# EAGLE design MotorControl (EAGLE 7.4.0)
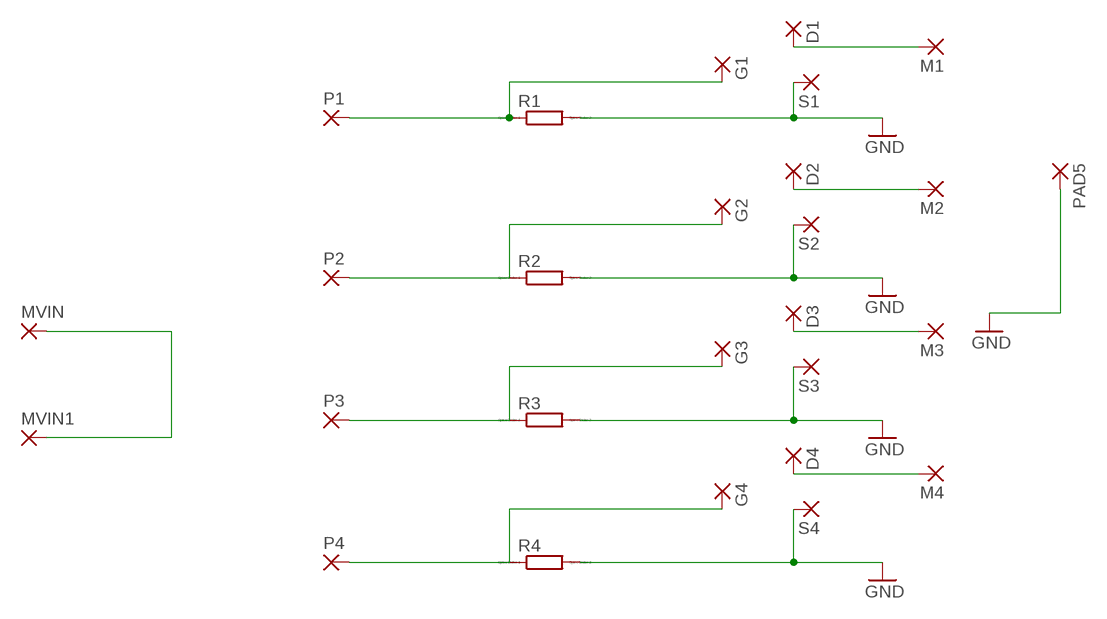
[diagram p0: schematic, sheet 1]

## Parts
D1  1,6/0,8  [1,6/0,8]
D2  1,6/0,8  [1,6/0,8]
D3  1,6/0,8  [1,6/0,8]
D4  1,6/0,8  [1,6/0,8]
G1  1,6/0,8  [1,6/0,8]
G2  1,6/0,8  [1,6/0,8]
G3  1,6/0,8  [1,6/0,8]
G4  1,6/0,8  [1,6/0,8]
M1  2,15/1,0  [2,15/1,0]
M2  2,15/1,0  [2,15/1,0]
M3  2,15/1,0  [2,15/1,0]
M4  2,15/1,0  [2,15/1,0]
MVIN  2,15/1,0  [2,15/1,0]
MVIN1  2,15/1,0  [2,15/1,0]
P1  2,15/1,0  [2,15/1,0]
P2  2,15/1,0  [2,15/1,0]
P3  2,15/1,0  [2,15/1,0]
P4  2,15/1,0  [2,15/1,0]
PAD5  2,15/1,0  [2,15/1,0]
R1  R0207/10  [0207/10]
R2  R0207/10  [0207/10]
R3  R0207/10  [0207/10]
R4  R0207/10  [0207/10]
S1  1,6/0,8  [1,6/0,8]
S2  1,6/0,8  [1,6/0,8]
S3  1,6/0,8  [1,6/0,8]
S4  1,6/0,8  [1,6/0,8]

## Nets
GND: PAD5.1(P) R1.2 R2.2 R3.2 R4.2 S1.1(P) S2.1(P) S3.1(P) S4.1(P)
N$1: G1.1(P) P1.1(P) R1.1
N$2: D1.1(P) M1.1(P)
N$3: G2.1(P) P2.1(P) R2.1
N$4: D3.1(P) M3.1(P)
N$5: G3.1(P) P3.1(P) R3.1
N$6: D4.1(P) M4.1(P)
N$7: G4.1(P) P4.1(P) R4.1
N$8: D2.1(P) M2.1(P)
N$9: MVIN1.1(P) MVIN.1(P)

## Library data of the parts
D1-D4 G1-G4 S1-S4 = wirepad:1,6/0,8: THROUGH-HOLE PAD
M1-M4 MVIN MVIN1 P1-P4 PAD5 = wirepad:2,15/1,0: THROUGH-HOLE PAD
R1-R4 = eagle-ltspice:R: RESISTOR, European symbol; SPICEMODEL: NONE; SPICEPREFIX: R

## Board
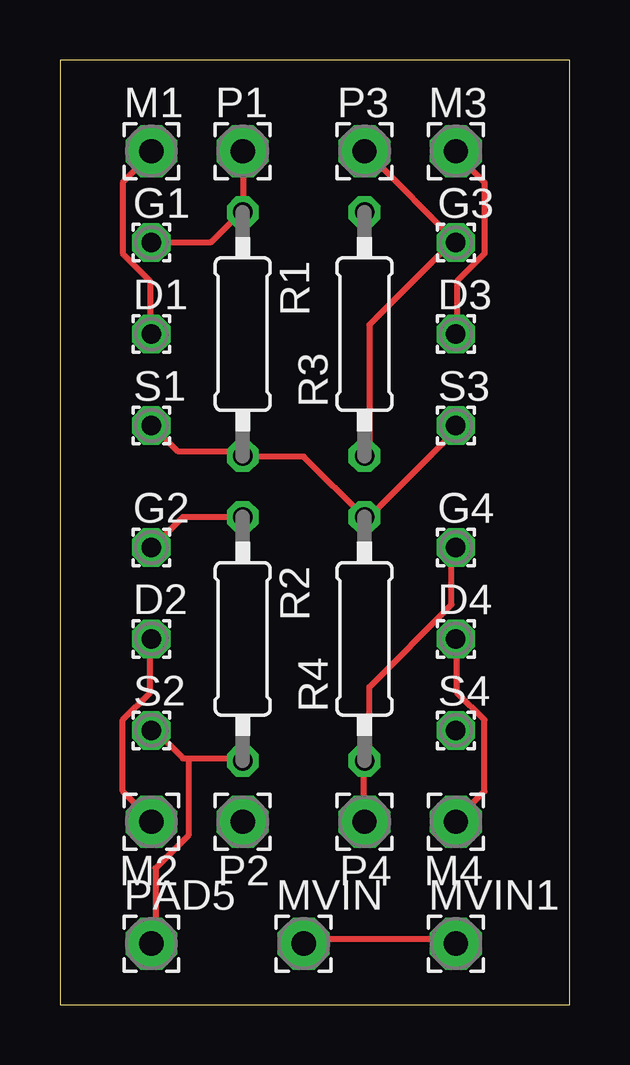
[diagram p1: board, top side]
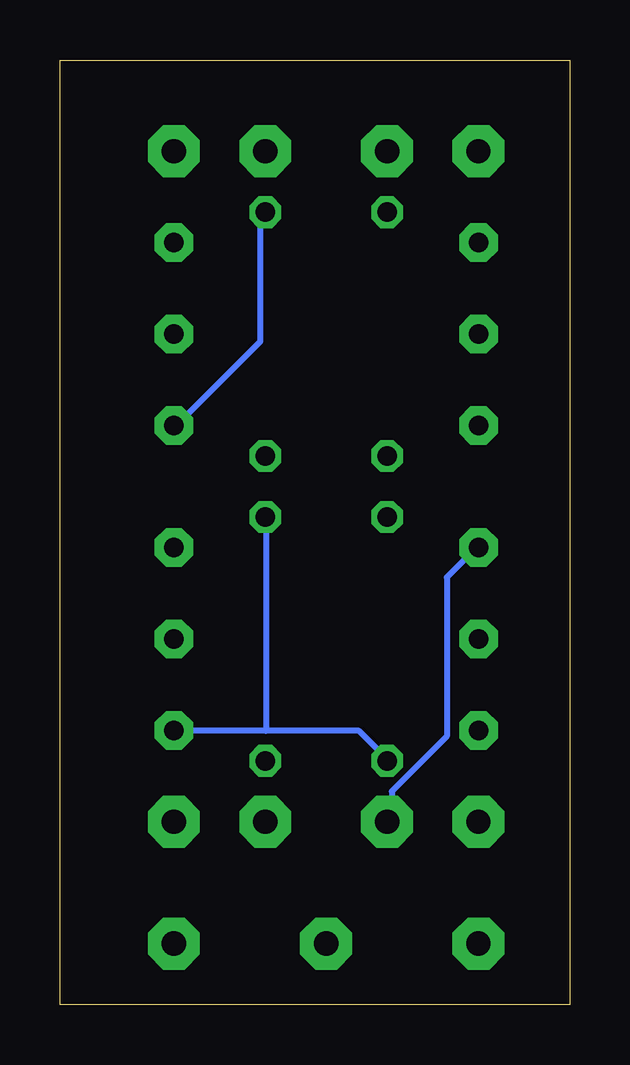
[diagram p2: board, bottom side, seen from below]

Size 21.26 x 39.36 mm. Coordinates in mm from the lower left corner, seen from the top.
Outline: 0,0 21.26,0 21.26,39.36 0,39.36 0,0
Copper layers (1*16): Top 0.035mm / dielectric 1.5mm / Bottom 0.035mm
Design rules "default": minimum track width 10mil, minimum drill 24mil, track to track 8mil, track to pad 8mil, pad to pad 8mil, via to via 8mil, smd to smd 8mil, copper to edge 40mil, drill to drill 8mil, minimum pad ring 10mil, minimum via ring 8mil, stop-mask expansion 4mil, vias tented up to drill 0mil, thermal gap 10mil

### Footprints (pad centres in the part's own frame; a part is rotated, then mirrored left to right if it is on the bottom)
1,6/0,8 = drill 0.813 pad 1.6 octagon: 1 0,0
2,15/1,0 = drill 1.016 pad 2.159 octagon: 1 0,0
0207/10 = drill 0.813 octagon: 1 -5.08,0; 2 5.08,0

### Placement (x,y rotation side)
D1  3.81,27.94 0 top
D2  3.81,15.24 0 top
D3  16.51,27.94 0 top
D4  16.51,15.24 0 top
G1  3.81,31.75 0 top
G2  3.81,19.05 0 top
G3  16.51,31.75 0 top
G4  16.51,19.05 0 top
M1  3.81,35.56 0 top
M2  3.81,7.62 180 top
M3  16.51,35.56 0 top
M4  16.51,7.62 180 top
MVIN  10.16,2.54 0 top
MVIN1  16.51,2.54 0 top
P1  7.62,35.56 0 top
P2  7.62,7.62 180 top
P3  12.7,35.56 0 top
P4  12.7,7.62 180 top
PAD5  3.81,2.54 0 top
R1  7.62,27.94 270 top
R2  7.62,15.24 270 top
R3  12.7,27.94 90 top
R4  12.7,15.24 90 top
S1  3.81,24.13 0 top
S2  3.81,11.43 0 top
S3  16.51,24.13 0 top
S4  16.51,11.43 0 top

### Tracks (layer width: path | path; a pad name or v marks a point on that pad's centre or on a via)
GND
  Top 0.254: 5.36,10.26 5.13,10.26 3.99,11.41 S2.1 | 5.36,10.26 7.42,10.26 R2.2 | 5.36,10.26 5.36,7.06 3.99,5.69 3.99,2.72 PAD5.1 | S1.1 3.99,23.98 4.9,23.06 7.42,23.06 R1.2 7.64,22.84 10.16,22.84 12.68,20.32 R4.2 12.9,20.32 16.56,23.98 S3.1
  Bottom 0.254: 12.68,11.41 8.79,11.41 7.64,10.26 R2.2 | 12.68,11.41 16.33,11.41 S4.1 | R3.2 12.9,32.89 12.9,27.63 16.33,24.21 S3.1 | 12.68,11.41 12.68,20.32 R4.2
N$1
  Top 0.254: P1.1 7.64,35.41 7.64,33.12 R1.1 7.42,32.89 6.27,31.75 G1.1
N$2
  Top 0.254: D1.1 3.76,28.09 3.76,30.15 2.62,31.29 2.62,34.27 3.76,35.41 M1.1
N$3
  Top 0.254: R2.1 5.13,20.32 3.99,19.18 G2.1
  Bottom 0.254: P2.1 7.42,7.75 7.42,8.89 5.13,11.18 5.13,17.8 3.99,18.95 G2.1
N$4
  Top 0.254: D3.1 16.56,28.09 16.56,30.15 17.7,31.29 17.7,34.27 16.56,35.41 M3.1
N$5
  Top 0.254: R3.1 12.9,23.06 12.9,28.32 16.33,31.75 G3.1 16.56,31.75 12.9,35.41 P3.1
N$6
  Top 0.254: D4.1 16.56,15.06 16.56,13.01 17.7,11.86 17.7,8.89 16.56,7.75 M4.1
N$7
  Top 0.254: P4.1 12.68,7.75 12.68,10.03 R4.1 12.9,10.26 12.9,13.23 16.33,16.66 16.33,18.95 G4.1
N$8
  Top 0.254: D2.1 3.76,15.06 3.76,13.01 2.62,11.86 2.62,8.89 3.76,7.75 M2.1
N$9
  Top 0.254: MVIN.1 10.16,2.72 16.33,2.72 MVIN1.1